# Altium schematic sheet SIH_Project.SchDoc: SENSOR PACKAGE FOR UNDERWATER MINERAL DETECTION
size A4; Date: 10/09/26; ApprovedBy: SATWIK PAVAN; CheckedBy: SATWIK PAVAN; Author: SATWIK PAVAN; DrawnBy: SATWIK PAVAN; Engineer: ECE ENGINEERING STUDENT; Organization: NSUT; DocumentNumber: 1; Revision: 1; SheetNumber: 1; SheetTotal: 1; Time: 3:00am
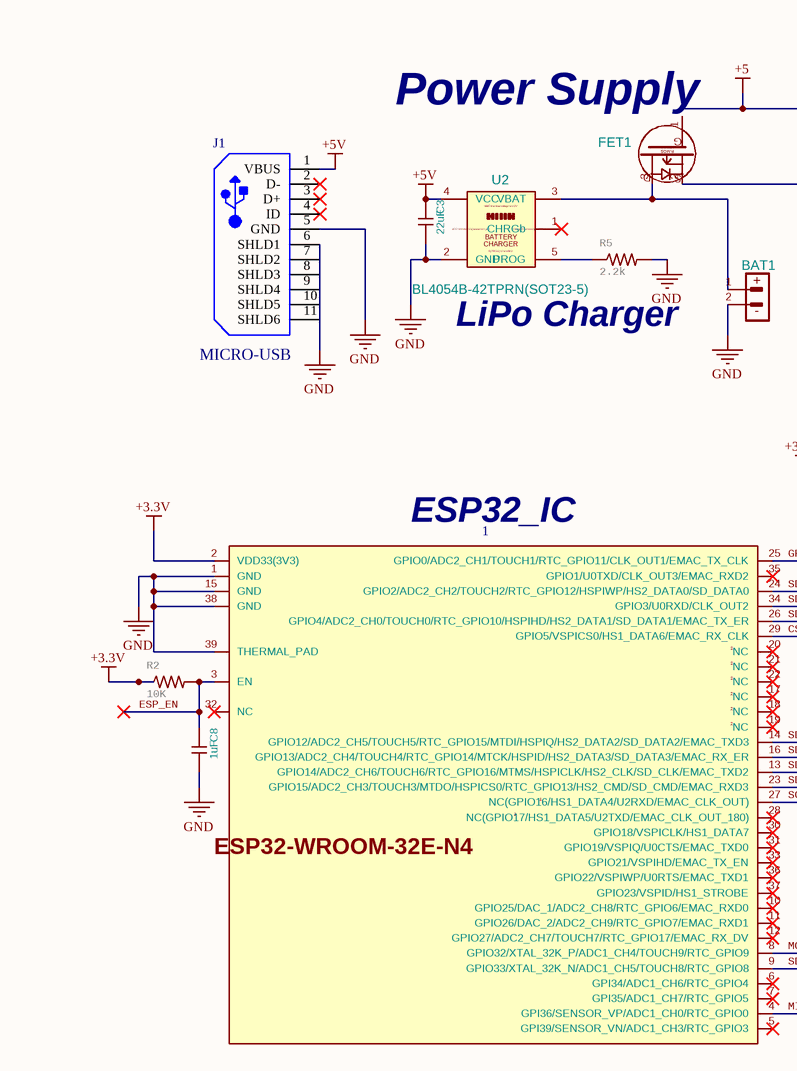
[diagram p0: SIH_Project.SchDoc, top left]
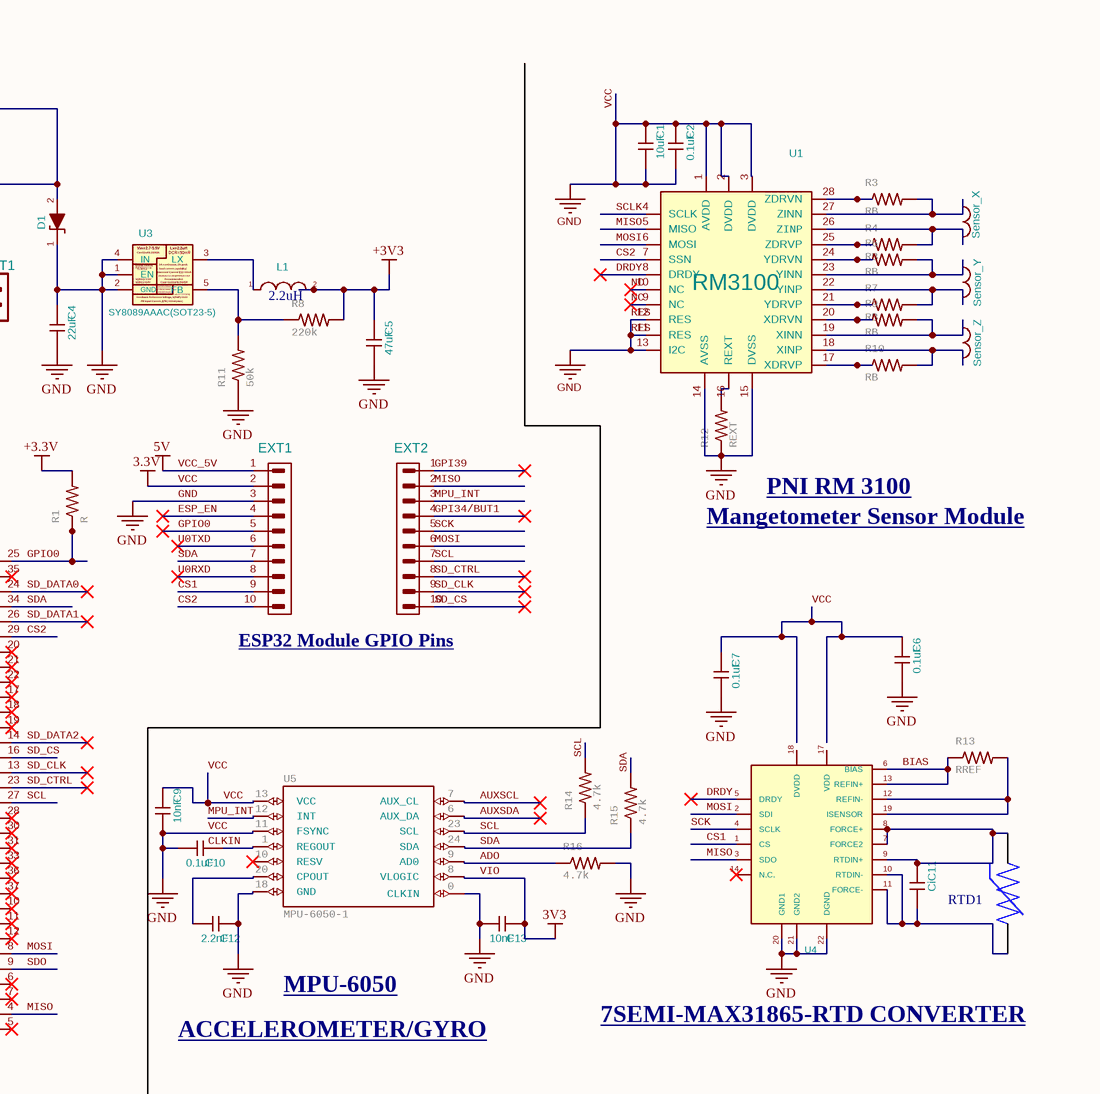
[diagram p1: SIH_Project.SchDoc, top right]
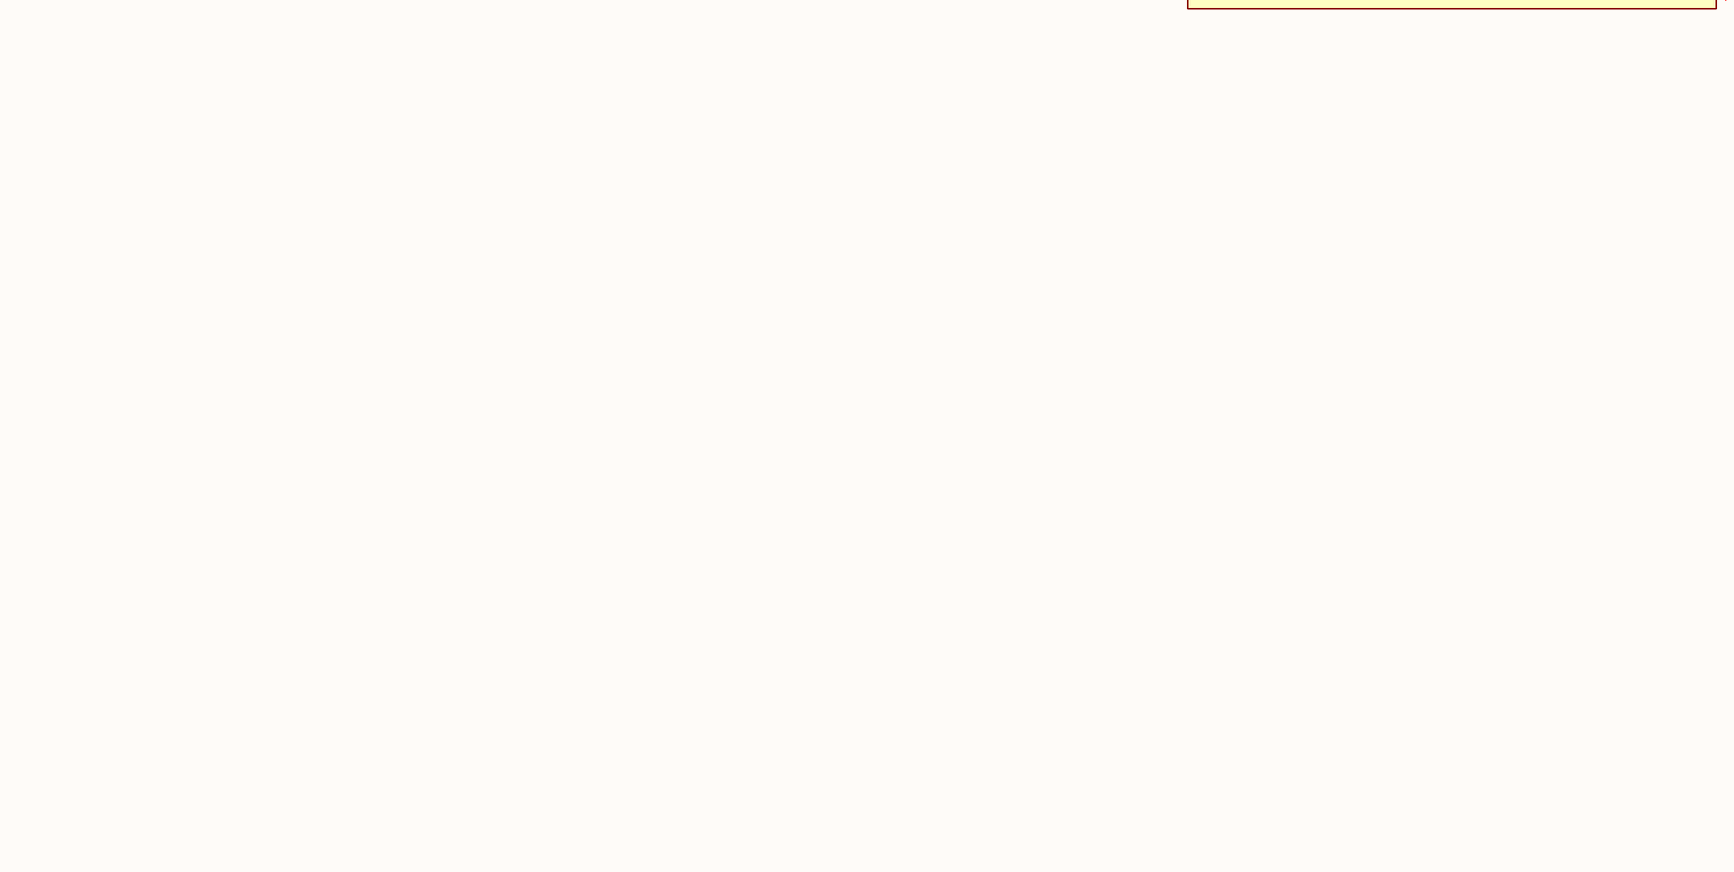
[diagram p2: SIH_Project.SchDoc, bottom left]
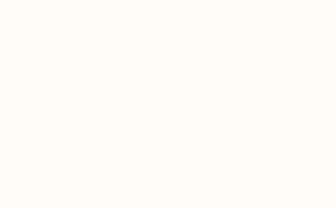
[diagram p3: SIH_Project.SchDoc, bottom right]

## Parts
1  ESP32-WROVER(WROOM)-UNIVERSAL  (value not drawn)
?  Sensor_X
BAT1  DW02S  [LIPO_BAT_VERTICAL_DW02S]  (value not drawn)
C1  10uF
C2  0.1uF
C3  value 22uF  (hidden comment: 10uF)
C4  value 22uF  (hidden comment: 10uF)
C5  value 47uF  (hidden comment: 10uF)
C6  value 0.1uF  (hidden comment: 10nF)
C7  value 0.1uF  (hidden comment: 10nF)
C8  value 1uF  (hidden comment: 10nF)
C9  10nF
C10  value 0.1uF  (hidden comment: 10nF)
C11  value Ci  (hidden comment: 10nF)
C12  value 2.2nF  (hidden comment: 10nF)
C13  10nF
D1  1N5822/SS34/SMA  [SMA-KA]  (value not drawn)
EXT1  NS(HN1x10)  [HN1x10]  (value not drawn)
EXT2  NS(HN1x10)  [HN1x10]  (value not drawn)
FET1  WPM2015-3/TR  [SOT23]  (value not drawn)
J1  10103594-0001LF  [FCI-10103594-0001LF_V]  (value not drawn)
L1  2.2uH  [CD32]
L_Y1  Sensor_Y
L_Z1  Sensor_Z
R1  R  [0603-RES]
R2  10K  [0603-RES]
R3  RB  [0603-RES]
R4  RB  [0603-RES]
R5  2.2k  [0603-RES]
R6  RB  [0603-RES]
R7  RB  [0603-RES]
R8  220k  [0603-RES]
R9  RB  [0603-RES]
R10  RB  [0603-RES]
R11  50k  [0603-RES]
R12  REXT  [0603-RES]
R13  RREF  [0603-RES]
R14  4.7k  [0603-RES]
R15  4.7k  [0603-RES]
R16  4.7k  [0603-RES]
RTD1  NCU15WF104D60RC  [THRMC1005X55N]  (value not drawn)
U1  RM3100
U2  BL4054B-42TPRN(SOT23-5)  [SOT-23-5]
U3  SY8089AAAC(SOT23-5)  [SOT-23-5]
U4  MAX31865  (value not drawn)
U5  MPU-6050-1  [QFN-24-4MM2]

## Nets
+3.3V: 1.2(VDD33(3V3)) R1.2 R2.1
+3V3: C5.2 L1.2 R8.2
+5: D1.2(A) FET1.2
+5V: C3.2 J1.1(VBUS) U2.4(VCC)
GND: 1.1(GND) 1.15(GND) 1.38(GND) 1.39(THERMAL_PAD) BAT1.2 C1.1 C1.2 C2.1 C2.2 C3.1 C4.1 C4.2 C5.1 C6.1 C6.2 C7.1 C7.2 C8.1 C9.1 C9.2 C10.1 C12.2 C13.1 D1.1(K) EXT1.2 EXT1.3 J1.5(GND) J1.11(SHLD6) R5.2 R11.1 R12.1 R16.2 U1.1(AVDD) U1.2(DVDD) U1.3(DVDD) U1.11(RES) U1.12(RES) U1.13(I2C) U1.14(AVSS) U1.15(DVSS) U2.2(GND) U3.1(EN) U3.2(GND) U3.4(IN) U4.20(GND1) U4.21(GND2) U4.22(DGND) U5.0(CLKIN) U5.11(FSYNC) U5.13(VCC) U5.18(GND)  [also labelled 3.3V, RES, VCC]
VCC_5V: EXT1.1  [also labelled 5V]
VIO: C13.2 U5.8(VLOGIC)  [also labelled 3V3]
ADO: R16.1 U5.9(AD0)
AUXSCL: U5.7(AUX_CL)
AUXSDA: U5.6(AUX_DA)
BIAS: R13.1 U4.6(BIAS) U4.13(REFIN+)
CS1: EXT1.9 U4.1(CS)
CS2: 1.29(GPIO5/VSPICS0/HS1_DATA6/EMAC_RX_CLK) EXT1.10 U1.7(SSN)
DRDY: U1.8(DRDY) U4.5(DRDY)
ESP_EN: 1.3(EN) C8.2 EXT1.4 R2.2
GPI34/BUT1: EXT2.4
GPI39: EXT2.1
GPIO0: 1.25(GPIO0/ADC2_CH1/TOUCH1/RTC_GPIO11/CLK_OUT1/EMAC_TX_CLK) EXT1.5 R1.1
MISO: 1.4(GPI36/SENSOR_VP/ADC1_CH0/RTC_GPIO0) EXT2.2 U1.5(MISO) U4.3(SDO)
MOSI: 1.8(GPIO32/XTAL_32K_P/ADC1_CH4/TOUCH9/RTC_GPIO9) EXT2.6 U1.6(MOSI) U4.2(SDI)
MPU_INT: EXT2.3 U5.12(INT)
NC: U1.9(NC) U1.10(NC)
SCK: EXT2.5 U4.4(SCLK)
SCL: 1.27(NC(GPIO16/HS1_DATA4/U2RXD/EMAC_CLK_OUT)) EXT2.7 R14.1 R14.2 U5.23(SCL)
SCLK: U1.4(SCLK)
SD_CLK: 1.13(GPIO14/ADC2_CH6/TOUCH6/RTC_GPIO16/MTMS/HSPICLK/HS2_CLK/SD_CLK/EMAC_TXD2) EXT2.9
SD_CS: 1.16(GPIO13/ADC2_CH4/TOUCH4/RTC_GPIO14/MTCK/HSPID/HS2_DATA3/SD_DATA3/EMAC_RX_ER) EXT2.10
SD_CTRL: 1.23(GPIO15/ADC2_CH3/TOUCH3/MTDO/HSPICS0/RTC_GPIO13/HS2_CMD/SD_CMD/EMAC_RXD3) EXT2.8
SD_DATA0: 1.24(GPIO2/ADC2_CH2/TOUCH2/RTC_GPIO12/HSPIWP/HS2_DATA0/SD_DATA0)
SD_DATA1: 1.26(GPIO4/ADC2_CH0/TOUCH0/RTC_GPIO10/HSPIHD/HS2_DATA1/SD_DATA1/EMAC_TX_ER)
SD_DATA2: 1.14(GPIO12/ADC2_CH5/TOUCH5/RTC_GPIO15/MTDI/HSPIQ/HS2_DATA2/SD_DATA2/EMAC_TXD3)
SDA: 1.34(GPIO3/U0RXD/CLK_OUT2) EXT1.7 R15.1 R15.2 U5.24(SDA)
SDO: 1.9(GPIO33/XTAL_32K_N/ADC1_CH5/TOUCH8/RTC_GPIO8)
U0RXD: EXT1.8
U0TXD: EXT1.6
Net?_1: ?.1 R4.2 U1.26(ZINP)
Net?_2: ?.2 R3.2 U1.27(ZINN)
NetBAT1_1: BAT1.1 FET1.3 U2.3(VBAT)
NetC10_2: C10.2 U5.1(REGOUT)
NetC11_1: C11.1 RTD1.2 U4.10(RTDIN-) U4.11(FORCE-)
NetC11_2: C11.2 RTD1.1 U4.7(FORCE2) U4.8(FORCE+) U4.9(RTDIN+)
NetC12_1: C12.1 U5.20(CPOUT)
NetL1_1: L1.1 U3.3(LX)
NetL_Y1_1: L_Y1.1 R7.2 U1.22(YINP)
NetL_Y1_2: L_Y1.2 R6.2 U1.23(YINN)
NetL_Z1_1: L_Z1.1 R10.2 U1.18(XINP)
NetL_Z1_2: L_Z1.2 R9.2 U1.19(XINN)
NetR3_1: R3.1 U1.28(ZDRVN)
NetR4_1: R4.1 U1.25(ZDRVP)
NetR5_1: R5.1 U2.5(PROG)
NetR6_1: R6.1 U1.24(YDRVN)
NetR7_1: R7.1 U1.21(YDRVP)
NetR8_1: R8.1 R11.2 U3.5(FB)
NetR9_1: R9.1 U1.20(XDRVN)
NetR10_1: R10.1 U1.17(XDRVP)
NetR12_2: R12.2 U1.16(REXT)
NetR13_2: R13.2 U4.12(REFIN-) U4.19(ISENSOR)

Not connected (* = marked no-connect by the designer): 1 5(GPI39/SENSOR_VN/ADC1_CH3/RTC_GPIO3)* 6(GPI34/ADC1_CH6/RTC_GPIO4)* 7(GPI35/ADC1_CH7/RTC_GPIO5)* 10(GPIO25/DAC_1/ADC2_CH8/RTC_GPIO6/EMAC_RXD0)* 11(GPIO26/DAC_2/ADC2_CH9/RTC_GPIO7/EMAC_RXD1)* 12(GPIO27/ADC2_CH7/TOUCH7/RTC_GPIO17/EMAC_RX_DV)* 17(NC)* 18(NC)* 19(NC)* 20(NC)* 21(NC)* 22(NC)* 28(NC(GPIO17/HS1_DATA5/U2TXD/EMAC_CLK_OUT_180))* 30(GPIO18/VSPICLK/HS1_DATA7)* 31(GPIO19/VSPIQ/U0CTS/EMAC_TXD0)* 32(NC)* 33(GPIO21/VSPIHD/EMAC_TX_EN)* 35(GPIO1/U0TXD/CLK_OUT3/EMAC_RXD2)* 36(GPIO22/VSPIWP/U0RTS/EMAC_TXD1)* 37(GPIO23/VSPID/HS1_STROBE)*; FET1 1; J1 2(D-)* 3(D+)* 4(ID)* 6(SHLD1) 7(SHLD2) 8(SHLD3) 9(SHLD4) 10(SHLD5); U2 1(CHRGb)*; U4 14(N.C.)* 17(VDD) 18(DVDD); U5 10(RESV)*

## Notes on the sheet
- (near FET1) Power Supply
- (near J1) MICRO-USB
- LiPo Charger
- (near 1) ESP32_IC
- Mangetometer Sensor Module
- (near R12) PNI RM 3100
- ESP32 Module GPIO Pins
- ACCELEROMETER/GYRO
- MPU-6050
- 7SEMI-MAX31865-RTD CONVERTER
- Labels drawn without touching a wire or pin: CLKIN
- (in symbol BAT_CON) +; -
- (in symbol BL4054B-42TPRN(SOT23-5)) VBAT final float voltage to 4.2V; VCC=4.5V to 6.5V(at least a 1 μF); Charge Current Up to 800mA; BATTERY; CHARGER; R(PROG)=2 to 10kΩ
- (in symbol ESP32-WROVER(WROOM)-UNIVERSAL) 2.; 1.; ESP32-WROOM-32E-N4
- (in symbol P-MOS+DIOD) G; P-MOS; D; S
- (in symbol SY8009AAAC(SOT23-5)) Vin=2.7-5.5V; Lx=2.2uH; Cin=22uF/6.3V/X5R; DCR<50mR; Do not float.; Pull high to turn on.; Enable control.; load current capability!; 2A continuous, 3A peak; Quiescent Current I(Q)=55uA; Shutdown Current I(SHDN)=0.1-1uA; V(ENL)=0.4V; V(ENH)=1.5V; Cout=2x22uF/6.3V/X5R; Recommended:; SY8089AAAC; Part Number:; SY8089AAC; Feedback Reference Voltage, V(REF)=0.6V; Vout=0.6*(1+Ra/Rb); FB Input Current, I(FB)=50nA(max)

## Library data of the parts
? L1 L_Y1 L_Z1 = L
  ?: Value: Sensor_X
  L_Y1: Value: Sensor_Y
  L_Z1: Value: Sensor_Z
BAT1 = BAT_CON
C1-C13 = C
  C1: Value: 10uF
  C2: Value: 0.1uF
  C9 C13: Value: 10nF
D1 = D_Schottky
EXT1 EXT2 = CON10
FET1 = P-MOS+DIOD
J1 = CMP-002-00038-2: Micro USB 2.0 B Receptacle, 5 Position, Height 3.24 mm, -55 to 85 degC, RoHS, Tape and Reel; Manufacturer: FCI Electronics; Gender: Female; Current Rating: 1.8A; Voltage Rating: 100V; Min Operating Temperature: -55°C; Package Reference: FCI-10103594-0001LF; Max Operating Temperature: 85°C; Lead Pitch: 0.65mm; Case/Package: FCI-10103594-0001LF; Package Quantity: 1500; Connector Type: USB; Mounting Technology: SM; Datasheet Version: Rev. A, 06/2010; Contact Material: Copper; Package Description: 5-Pin Surface Mount Device, Body 8.04 x 5.62 mm; Contact Plating: Gold; Packaging: TapeandReel; Datasheet URL: http://portal.fciconnect.com/Comergent//fci/drawing/10103594.pdf; Pins: 5; RoHS Compliant: True; Manufacturer URL: http://portal.fciconnect.com/
R1-R16 = RESISTOR0603-RES: ResistorBasic schematic elements and footprints for 0603, 1206, and PTH resistors.; GateName_1: G$1; SymbolName_1: RESISTOR; DeviceName: 0603-RES; LibraryName: SparkFun; DeviceSetName: RESISTOR
RTD1 = CMP-005-000000-1: Thermistors, NTC Thermistors, NTC for Temperature Sensor; MF: Murata; MP: NCU15WF104D60RC; Package: 1005 Taiyo Yuden; Value: *; Pin Count: 2; Design Item ID: NCU15WF104D60RC; Component Type: Standard; Check_prices: https://www.snapeda.com/parts/NCU15WF104D60RC/Murata/view-part/?ref=eda; Source: NCU15WF104D60RC.SchLib; SnapEDA_Link: https://www.snapeda.com/parts/NCU15WF104D60RC/Murata/view-part/?ref=snap
U3 = SY8009AAAC(SOT23-5): Value: SY8089AAAC(SOT23-5)
U5 = MPU-6050-1: GateName_1: G$1; DeviceName: -1; SymbolName_1: MPU-6050; LibraryName: Testing; DeviceSetName: MPU-6050
U1 = RM3100: Value: RM3100
U2 = BL4054B-42TPRN(SOT23-5): Value: BL4054B-42TPRN(SOT23-5)
U4 = MAX31865: Value: MAX31865